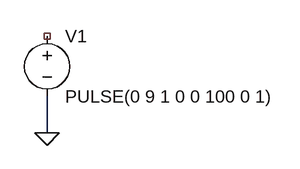
[diagram p0: schematic Draft1.asc]
Draft1.asc, the LTspice schematic file:
Version 4
SHEET 1 880 680
WIRE -96 240 -96 192
FLAG -96 240 0
SYMBOL voltage -96 96 R0
WINDOW 123 0 0 Left 2
WINDOW 39 0 0 Left 2
SYMATTR InstName V1
SYMATTR Value PULSE(0 9 1 0 0 100 0 1)

The netlist it stands for:
* Draft1.asc
V1 NC_01 0 PULSE(0 9 1 0 0 100 0 1)
.backanno
.end